# Altium schematic sheet Sheet1.SchDoc
size A; SheetNumber: 1; SheetTotal: 1
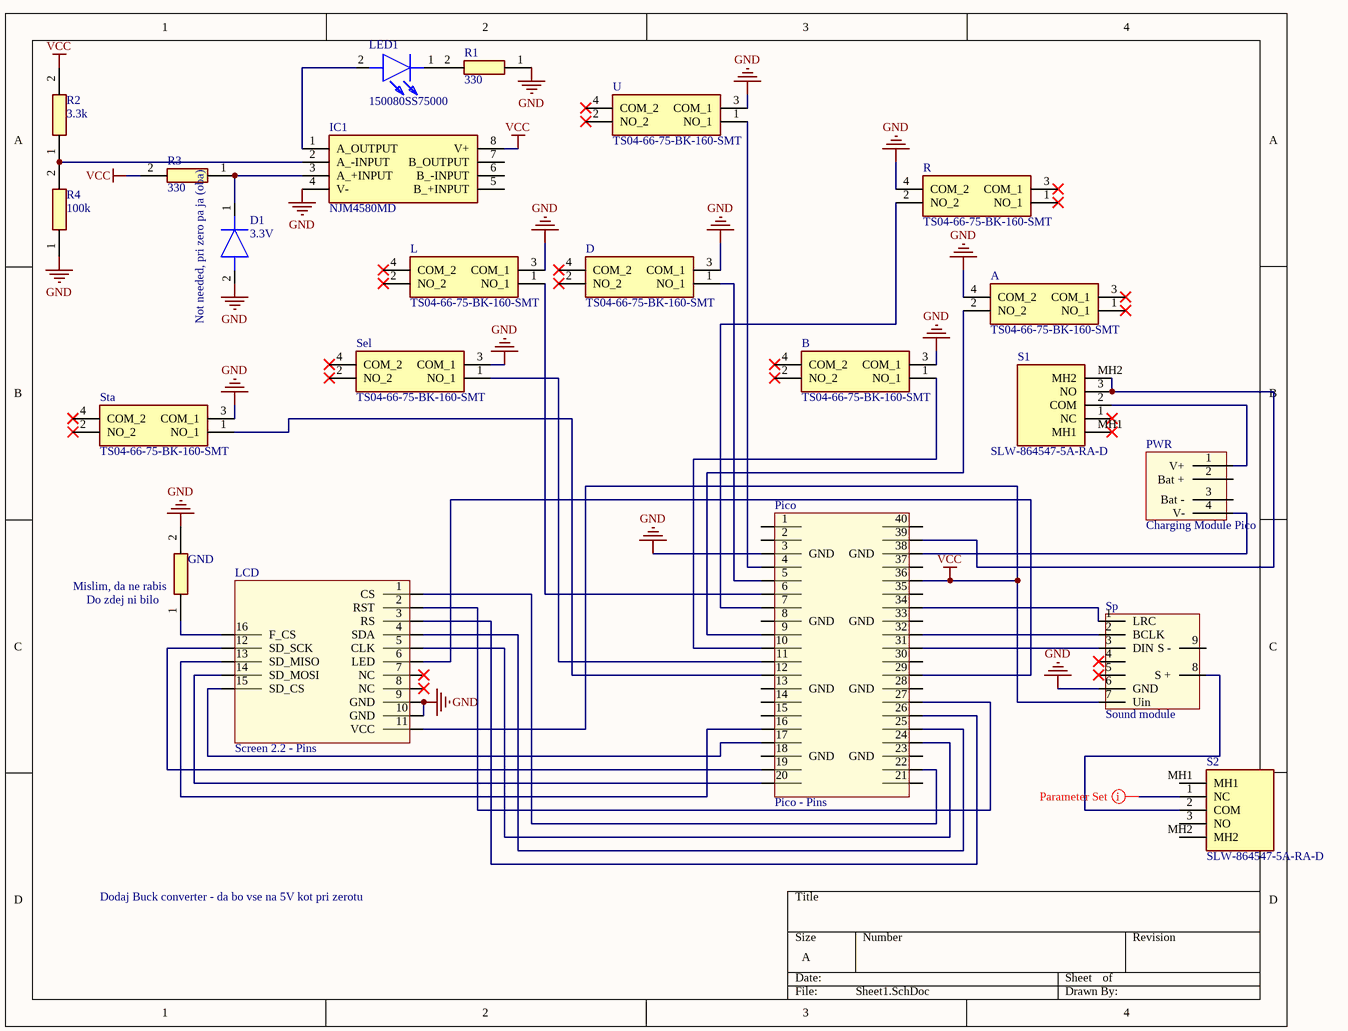
[diagram p0: Sheet1.SchDoc]

## Parts
A  TS04-66-75-BK-160-SMT  [TS046675BK160SMT]
B  TS04-66-75-BK-160-SMT  [TS046675BK160SMT]
D  TS04-66-75-BK-160-SMT  [TS046675BK160SMT]
D1  3.3V  [DIOM5027X244N]
GND  RA73F2A10KBTDF  [RESC2012X58N]  (value not drawn)
IC1  NJM4580MD  [SOIC127P680X200-8N]
L  TS04-66-75-BK-160-SMT  [TS046675BK160SMT]
LCD  Screen 2.2 - Pins  [LCD 2.2'']
LED1  150080SS75000  [LEDC2012X80N]
Pico  Pico - Pins  [Pico]
PWR  Charging Module Pico  [Charging Module - Pico]
R  TS04-66-75-BK-160-SMT  [TS046675BK160SMT]
R1  330  [RESC3116X75N]
R2  3.3k  [RESC3116X75N]
R3  330  [RESC3116X75N]
R4  100k  [RESC3116X75N]
S1  SLW-864547-5A-RA-D  [SLW8645475ARAD]
S2  SLW-864547-5A-RA-D  [SLW8645475ARAD]
Sel  TS04-66-75-BK-160-SMT  [TS046675BK160SMT]
Sp  Sound module  [Audio module]
Sta  TS04-66-75-BK-160-SMT  [TS046675BK160SMT]
U  TS04-66-75-BK-160-SMT  [TS046675BK160SMT]

## Nets
GND: A.4(COM_2) B.3(COM_1) D.3(COM_1) D1.2(A) GND.2 IC1.4(V-) L.3(COM_1) LCD.9(GND) LCD.10(GND) Pico.3(GND) R.4(COM_2) R1.1 R4.1 Sel.3(COM_1) Sp.6(GND) Sta.3(COM_1) U.3(COM_1)
VCC: IC1.8(V+) LCD.11(VCC) Pico.36 R2.2 R3.2 Sp.7(Uin)
NetA_2: A.2(NO_2) Pico.9
NetB_1: B.1(NO_1) Pico.10
NetD1_1: D1.1(K) IC1.3(A_+INPUT) R3.1
NetD_1: D.1(NO_1) Pico.5
NetGND_1: GND.1 LCD.16(F_CS)
NetIC1_1: IC1.1(A_OUTPUT) LED1.2(A)
NetIC1_2: IC1.2(A_-INPUT) R2.1 R4.2
NetL_1: L.1(NO_1) Pico.6
NetLCD_1: LCD.1(CS) Pico.22
NetLCD_2: LCD.2(RST) Pico.27
NetLCD_3: LCD.3(RS) Pico.26
NetLCD_4: LCD.4(SDA) Pico.25
NetLCD_5: LCD.5(CLK) Pico.24
NetLCD_6: LCD.6(LED) Pico.29
NetLCD_12: LCD.12(SD_SCK) Pico.19
NetLCD_13: LCD.13(SD_MISO) Pico.16
NetLCD_14: LCD.14(SD_MOSI) Pico.20
NetLCD_15: LCD.15(SD_CS) Pico.17
NetLED1_1: LED1.1(K) R1.2
NetPico_4: Pico.4 U.1(NO_1)
NetPico_7: Pico.7 R.2(NO_2)
NetPico_11: Pico.11 Sel.1(NO_1)
NetPico_12: Pico.12 Sta.1(NO_1)
NetPico_31: Pico.31 Sp.3(DIN)
NetPico_32: Pico.32 Sp.2(BCLK)
NetPico_34: Pico.34 Sp.1(LRC)
NetPico_38: Pico.38(GND) PWR.4(V-)
NetPico_39: Pico.39 S1.3(NO) S1.MH2
NetPWR_1: PWR.1(V+) S1.2(COM)
NetS2_2: S2.2(COM) Sp.8(S_+)

Not connected (* = marked no-connect by the designer): A 1(NO_1)* 3(COM_1)*; B 2(NO_2)* 4(COM_2)*; D 2(NO_2)* 4(COM_2)*; IC1 5(B_+INPUT) 6(B_-INPUT) 7(B_OUTPUT); L 2(NO_2)* 4(COM_2)*; LCD 7(NC)* 8(NC)*; Pico 1(22) 2 8(GND) 13(GND) 14 15 18(GND) 21(40) 23(GND) 28(GND) 30(31) 33(GND) 35(26) 37(24) 40(21); PWR 2(Bat_+) 3(Bat_-); R 1(NO_1)* 3(COM_1)*; S1 1(NC)* MH1*; S2 1(NC) 3(NO) MH1 MH2; Sel 2(NO_2)* 4(COM_2)*; Sp 4(17)* 5(17)* 9(S_-); Sta 2(NO_2)* 4(COM_2)*; U 2(NO_2)* 4(COM_2)*

## Notes on the sheet
- (near R3) Not needed, pri zero pa ja (oba)
- (near GND) Mislim, da ne rabis
- (near GND) Do zdej ni bilo
- Dodaj Buck converter - da bo vse na 5V kot pri zerotu

## Library data of the parts
A B D L R Sel Sta U = TS04-66-75-BK-160-SMT: Integrated Circuit; Manufacturer_Name: CUI Devices; Datasheet Link: https://www.mouser.es/ProductDetail/CUI-Devices/TS04-66-75-BK-160-SMT?qs=A6eO%252BMLsxmR5CIauYOve0Q%3D%3D; Height: 7.8mm; Manufacturer_Part_Number: TS04-66-75-BK-160-SMT; Mouser Part Number: 179-TS046675BK160SMT; Mouser Price/Stock: https://www.mouser.co.uk/ProductDetail/CUI-Devices/TS04-66-75-BK-160-SMT?qs=A6eO%252BMLsxmR5CIauYOve0Q%3D%3D; Arrow Part Number: TS04-66-75-BK-160-SMT; Arrow Price/Stock: https://www.arrow.com/en/products/ts04-66-75-bk-160-smt/cui-devices?region=nac
D1 = 1SMA4734-AU_R1_000A1: Diode; Manufacturer_Name: PANJIT; Datasheet Link: https://4donline.ihs.com/images/VipMasterIC/IC/PNJI/PNJI-S-A0006285883/PNJI-S-A0006285883-1.pdf?hkey=EF798316E3902B6ED9A73243A3159BB0; Height: 2.44mm; Manufacturer_Part_Number: 1SMA4734-AU_R1_000A1; Mouser Part Number: 241-1SMA4734AUR1000A; Mouser Price/Stock: https://www.mouser.co.uk/ProductDetail/Panjit/1SMA4734-AU_R1_000A1?qs=sPbYRqrBIVlu785ZCL03Rg%3D%3D
GND = RA73F2A10KBTDF: Resistor; Manufacturer_Name: TE Connectivity; Datasheet Link: https://www.mouser.in/datasheet/2/418/8/ENG_DS_1773270_3_A-2899722.pdf; Height: 0.58mm; Manufacturer_Part_Number: RA73F2A10KBTDF; Mouser Part Number: 279-RA73F2A10KBTDF; Mouser Price/Stock: https://www.mouser.co.uk/ProductDetail/TE-Connectivity-Holsworthy/RA73F2A10KBTDF?qs=Li%252BoUPsLEntqleNaLrqoUg%3D%3D
IC1 = NJM4580MD: Integrated Circuit; Manufacturer_Name: New Japan Radio; Height: 2mm; Manufacturer_Part_Number: NJM4580MD; Mouser Part Number: 513-NJM4580MD; Mouser Price/Stock: https://www.mouser.co.uk/ProductDetail/NJR/NJM4580MD?qs=7jPOr0kCrUAwyBYhTVaFCw%3D%3D
LED1 = 150080SS75000: LED; Manufacturer_Name: Wurth Elektronik; Datasheet Link: https://katalog.we-online.com/led/datasheet/150080SS75000.pdf; Height: 0.8mm; Manufacturer_Part_Number: 150080SS75000; Mouser Part Number: 710-150080SS75000; Mouser Price/Stock: https://www.mouser.co.uk/ProductDetail/Wurth-Elektronik/150080SS75000?qs=LlUlMxKIyB2zzpiaOzrUdw%3D%3D
R1-R4 = RQ73C2B10KBTD: Resistor; Manufacturer_Name: TE Connectivity; Datasheet Link: https://www.te.com/commerce/DocumentDelivery/DDEController?Action=showdoc&DocId=Data+Sheet%7F1773270-2%7FA%7Fpdf%7FEnglish%7FENG_DS_1773270-2_A.pdf%7F1-2176368-0; Height: 0.75mm; Manufacturer_Part_Number: RQ73C2B10KBTD; Mouser Part Number: 279-RQ73C2B10KBTD; Mouser Price/Stock: https://www.mouser.co.uk/ProductDetail/TE-Connectivity-Holsworthy/RQ73C2B10KBTD?qs=gZXFycFWdANWMnGuXdGmXg%3D%3D
S1 S2 = SLW-864547-5A-RA-D: Switch; Manufacturer_Name: Same Sky; Datasheet Link: https://www.cuidevices.com/product/resource/slw-864547-5a-ra-d.pdf; Height: 4.9mm; Manufacturer_Part_Number: SLW-864547-5A-RA-D; Mouser Part Number: 179-SLW-864547-5ARAD; Mouser Price/Stock: https://www.mouser.co.uk/ProductDetail/CUI-Devices/SLW-864547-5A-RA-D?qs=1Kr7Jg1SGW%252Bn%2FarYZIP3WQ%3D%3D; Arrow Part Number: SLW-864547-5A-RA-D; Arrow Price/Stock: null?region=nac